# EAGLE design MRF49XA (EAGLE 6.6.0)
DATABASE: ../../partsDB.txt
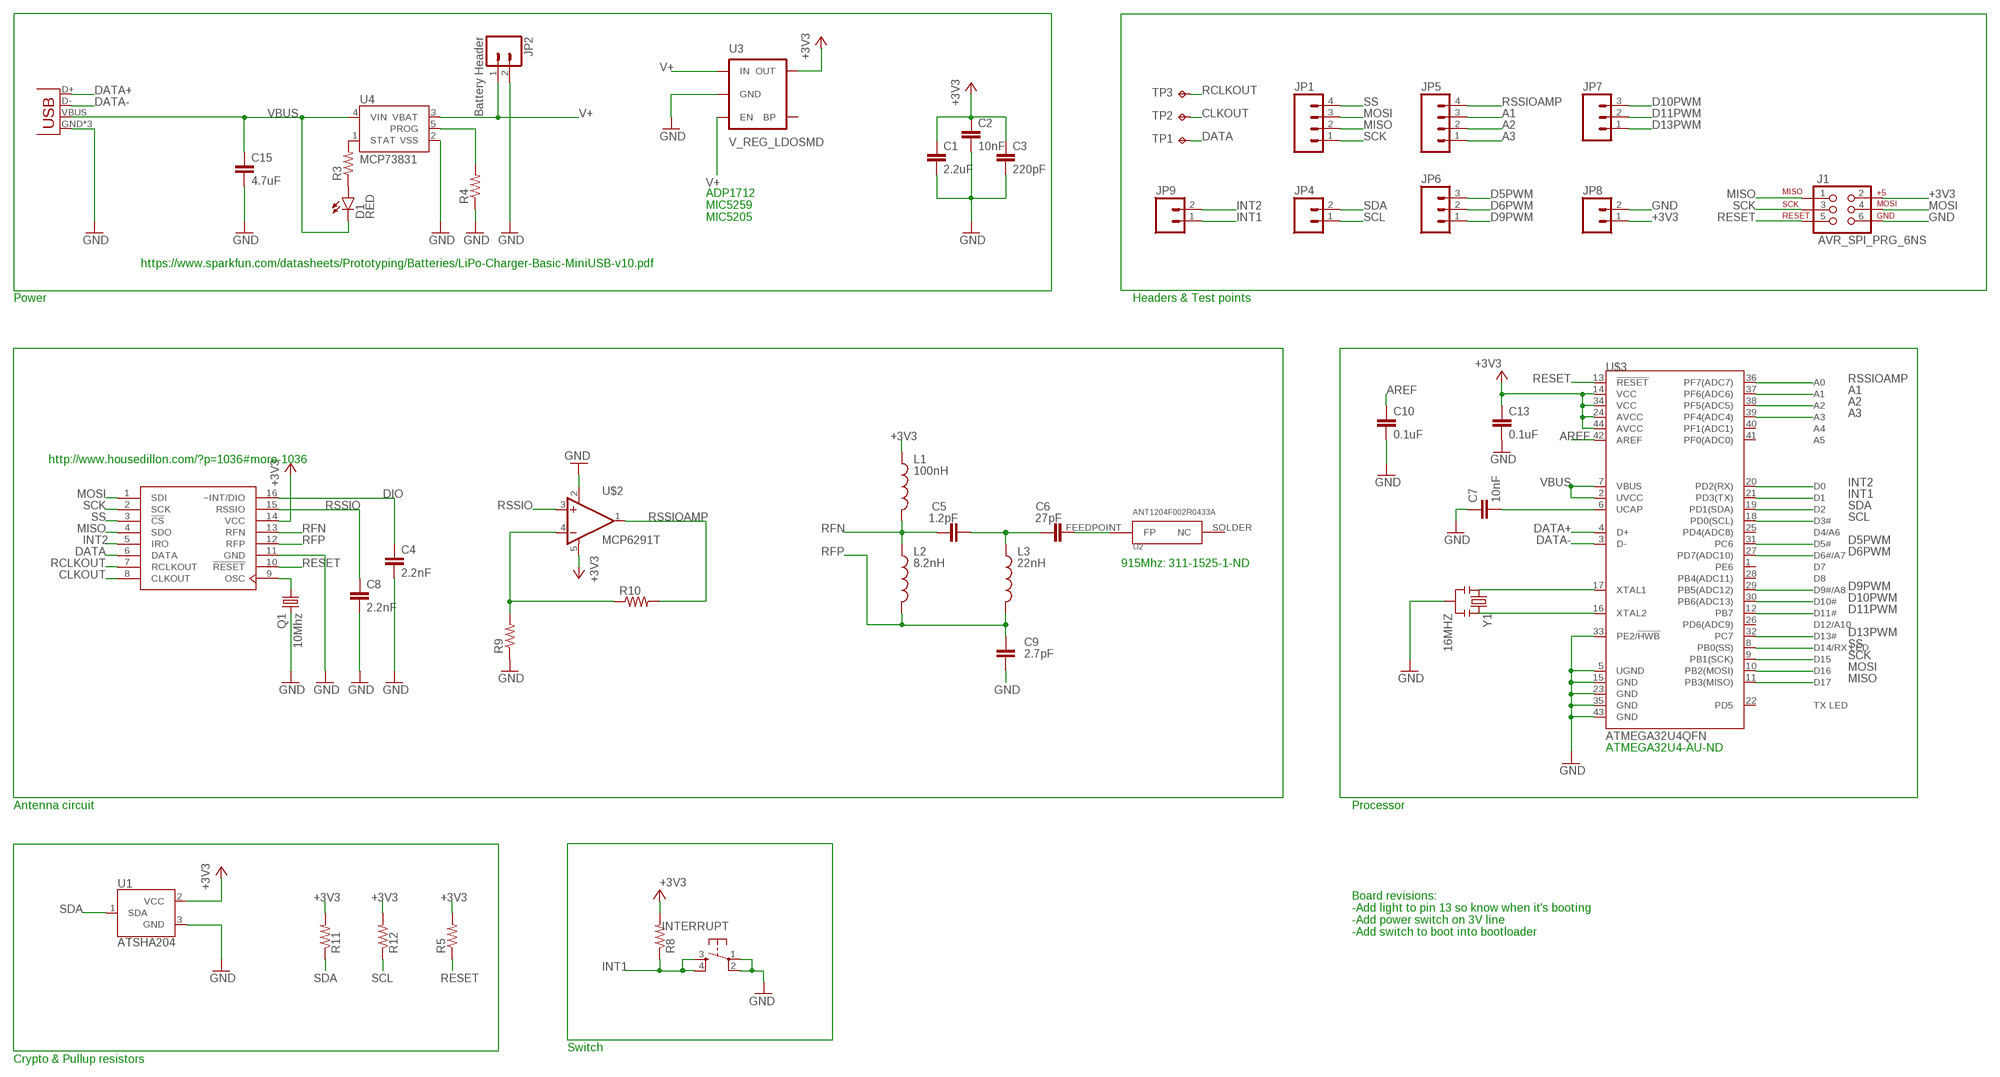
[diagram p0: schematic, sheet 1]

## Parts
C1  2.2uF  CAP0603-CAP  [0603-CAP]
C2  10nF  CAP0603-CAP  [0603-CAP]
C3  220pF  CAP0603-CAP  [0603-CAP]
C4  2.2nF  CAP0603-CAP  [0603-CAP]
C5  1.2pF  CAP0603-CAP  [0603-CAP]
C6  27pF  CAP0603-CAP  [0603-CAP]
C7  10nF  CAP0603-CAP  [0603-CAP]
C8  2.2nF  CAP0603-CAP  [0603-CAP]
C9  2.7pF  CAP0603-CAP  [0603-CAP]
C10  0.1uF  0.1UF-25V-5%(0603)  [0603-CAP]
C13  0.1uF  0.1UF-25V-5%(0603)  [0603-CAP]
C15  4.7uF  C-EUC3216  [C3216]
D1  RED  LED-RED0603  [LED-0603]
INTERRUPT  TAC_SWITCHSMD  [TACTILE-SWITCH-SMD]
J1  AVR_SPI_PRG_6NS  [2X3-NS]
JP1  M04PTH  [1X04]
JP2  Battery Header  M02LOCK_LONGPADS  [1X02_LOCK_LONGPADS]
JP3  USB-MICROB  [USB-MICROB]
JP4  M02PTH  [1X02]
JP5  M04PTH  [1X04]
JP6  M03PTH  [1X03]
JP7  M03PTH  [1X03]
JP8  M02PTH  [1X02]
JP9  M02PTH  [1X02]
L1  100nH  INDUCTOR0603  [0603]
L2  8.2nH  INDUCTOR0603  [0603]
L3  22nH  INDUCTOR0603  [0603]
Q1  10Mhz  CRYSTALCTS406  [CTS406]
R3  RESISTOR0603-RES  [0603-RES]
R4  R-US_R0603  [R0603]
R5  R-US_R0603  [R0603]
R8  R-US_R0603  [R0603]
R9  R-US_R0603  [R0603]
R10  R-US_R0603  [R0603]
R11  R-US_R0603  [R0603]
R12  R-US_R0603  [R0603]
TP1  TPTP08R  [TP08R]
TP2  TPTP08R  [TP08R]
TP3  TPTP08R  [TP08R]
U1  ATSHA204  ATSHA204-TSU  [SOT23-3]
U2  ANT1204F002R0433A  [ANT1204F002R0433A]
U3  V_REG_LDOSMD  [SOT23-5]
U4  MCP73831  [SOT23-5]
U$1  MRF49XA  [TSSOP16]
U$2  MCP6291T  MCP6291T-E/OT  [SOT23-5]
U$3  ATMEGA32U4QFN  [QFN-44]
Y1  16MHZ  RESONATOR8MHZ  [RESONATOR-SMD]

## Nets
+3V3: C1.1 C2.1 C3.1 C13.1 J1.2 JP8.1 L1.1 R5.2 R8.2 R11.2 R12.2 U1.2(VCC) U3.5(OUT) U$1.14(VCC) U$2.5(V+) U$3.14(VCC) U$3.24(AVCC) U$3.34(VCC) U$3.44(AVCC)
A1: JP5.3 U$3.37(PF6(ADC6))
A2: JP5.2 U$3.38(PF5(ADC5))
A3: JP5.1 U$3.39(PF4(ADC4))
AREF: C10.1 U$3.42(AREF)
CLKOUT: TP2.TP U$1.8(CLKOUT)
D5PWM: JP6.3 U$3.31(PC6)
D6PWM: JP6.2 U$3.27(PD7(ADC10))
D9PWM: JP6.1 U$3.29(PB5(ADC12))
D10PWM: JP7.3 U$3.30(PB6(ADC13))
D11PWM: JP7.2 U$3.12(PB7)
D13PWM: JP7.1 U$3.32(PC7)
DATA: TP1.TP U$1.6(DATA)
DATA+: JP3.D+ U$3.4(D+)
DATA-: JP3.D- U$3.3(D-)
DIO: C4.1 U$1.16(~INT/DIO)
GND: C1.2 C2.2 C3.2 C4.2 C7.1 C8.2 C9.2 C10.2 C13.2 C15.2 INTERRUPT.1 INTERRUPT.2 J1.6 JP2.2 JP3.GND JP3.MT1(GND) JP3.MT2(GND) JP8.2 Q1.3 R4.1 R9.1 U1.3(GND) U3.2(GND) U4.2(VSS) U$1.11(GND) U$2.2(V-) U$3.5(UGND) U$3.15(GND) U$3.23(GND) U$3.33(PE2/!HWB) U$3.35(GND) U$3.43(GND) Y1.2
INT1: INTERRUPT.3 INTERRUPT.4 JP9.1 R8.1 U$3.21(PD3(TX))
INT2: JP9.2 U$1.5(IRO) U$3.20(PD2(RX))
MISO: J1.1 JP1.2 U$1.4(SDO) U$3.11(PB3(MISO))
MOSI: J1.4 JP1.3 U$1.1(SDI) U$3.10(PB2(MOSI))
N$1: Q1.1 U$1.9(OSC)
N$2: U$3.16(XTAL2) Y1.3
N$3: U$3.17(XTAL1) Y1.1
N$5: R3.2 U4.1(STAT)
N$6: D1.A R3.1
N$8: R4.2 U4.5(PROG)
N$12: C7.2 U$3.6(UCAP)
N$14: C5.2 C6.1 L3.1
N$16: R9.2 R10.1 U$2.4(-IN)
N$17: C6.2 U2.FEEDPOINT(FP)
RCLKOUT: TP3.TP U$1.7(RCLKOUT)
RESET: J1.5 R5.1 U$1.10(!RESET) U$3.13(!RESET)
RFN: C5.1 L1.2 L2.1 U$1.13(RFN)
RFP: C9.1 L2.2 L3.2 U$1.12(RFP)
RSSIO: C8.1 U$1.15(RSSIO) U$2.3(+IN)
RSSIOAMP: JP5.4 R10.2 U$2.1(OUT) U$3.36(PF7(ADC7))
SCK: J1.3 JP1.1 U$1.2(SCK) U$3.9(PB1(SCK))
SCL: JP4.1 R12.1 U$3.18(PD0(SCL))
SDA: JP4.2 R11.1 U1.1(SDA) U$3.19(PD1(SDA))
SS: JP1.4 U$1.3(!CS) U$3.8(PB0(SS))
V+: JP2.1 U3.1(IN) U3.3(EN) U4.3(VBAT)
VBUS: C15.1 D1.C JP3.VBUS U4.4(VIN) U$3.2(UVCC) U$3.7(VBUS)
Unconnected: U2.SOLDER(NC) U3.4(BP) U$3.1(PE6) U$3.22(PD5) U$3.25(PD4(ADC8)) U$3.26(PD6(ADC9)) U$3.28(PB4(ADC11)) U$3.40(PF1(ADC1)) U$3.41(PF0(ADC0))

## Notes on the sheet
- ADP1712
  MIC5259
  MIC5205
- https://www.sparkfun.com/datasheets/Prototyping/Batteries/LiPo-Charger-Basic-MiniUSB-v10.pdf
- Power | Headers & Test points
- http://www.housedillon.com/?p=1036#more-1036
- 915Mhz: 311-1525-1-ND
- ATMEGA32U4-AU-ND
- Antenna circuit | Processor
- Board revisions:
  -Add light to pin 13 so know when it's booting
  -Add power switch on 3V line
  -Add switch to boot into bootloader
- Switch
- Crypto & Pullup resistors

## Power pins joined to a net without a drawn wire
VSS: U$1.P$1(VSS)

## Library data of the parts
C1 C5 C6 C9 = SparkFun-Passives:CAP: Capacitor Standard 0603 ceramic capacitor, and 0.1" leaded capacitor.
C2-C4 C7 C8 = SparkFun-Capacitors:CAP: Capacitor Standard 0603 ceramic capacitor, and 0.1" leaded capacitor.
C10 C13 = SparkFun-Capacitors:0.1UF-25V-5%(0603): CAP-08604; PROD_ID: CAP-08604
C15 = rcl:C-EU: CAPACITOR, European symbol
D1 = SparkFun-LED:LED-RED: Assorted Red LEDs LilyPad 1206- DIO-09912 1206- DIO-00809 0603- DIO-00819; PROD_ID: DIO-00819
INTERRUPT = SparkFun-Electromechanical:TAC_SWITCH: Momentary Switch Button commonly used for reset or general input. Spark Fun Electronics SKU : COM-00097 SMT- SWCH-08247
J1 = SparkFun-Connectors:AVR_SPI_PRG_6: AVR ISP 6 Pin This is the reduced ISP connector for AVR programming. Common on Arduino. This footprint will take up less PCB space and can be used with a 10-pin to 6-pin adapter such as SKU: BOB-08508 **Special note about "TEST_POINT" package. The stop mask is on the top side, so if you want your programming test points to be on the bottom of your board, make sure to place this package on the bottom side of the board. This also ensure that the orientation to program from the bottom side will be correct.
JP1 JP5 = SparkFun-Connectors:M04: Header 4 Standard 4-pin 0.1" header. Use with straight break away headers (SKU : PRT-00116), right angle break away headers (PRT-00553), swiss pins (PRT-00743), machine pins (PRT-00117), and female headers (PRT-00115). Molex polarized connector foot print use with SKU : PRT-08231 with associated crimp pins and housings. 1MM SMD Version SKU: PRT-10208
JP2 JP4 JP8 JP9 = SparkFun-Connectors:M02: Standard 2-pin 0.1" header. Use with - straight break away headers ( PRT-00116) - right angle break away headers (PRT-00553) - swiss pins (PRT-00743) - machine pins (PRT-00117) - female headers (PRT-00115) Molex polarized connector foot print use with: PRT-08233 with associated crimp pins and housings. 2.54_SCREWTERM for use with PRT-10571. 3.5mm Screw Terminal footprints for PRT-08084 5mm Screw Terminal footprints for use with PRT-08433
JP3 = SparkFun-Connectors:USB: USB Connectors USB-B-PTH is fully proven SKU : PRT-00139/CONN-08278 USB-miniB is fully proven SKU : PRT-00587 USB-A-PCB is untested. USB-A-H is throughly reviewed, but untested. Spark Fun Electronics SKU : PRT-00437 USB-B-SMT is throughly reviewed, but untested. Needs silkscreen touching up. USB-A-S has not been used/tested USB-MB-H has not been used/tested USB-MICROB has been used. CONN-09505; PROD_ID: CONN-09505
JP6 JP7 = SparkFun-Connectors:M03: Header 3 Standard 3-pin 0.1" header. Use with straight break away headers (SKU : PRT-00116), right angle break away headers (PRT-00553), swiss pins (PRT-00743), machine pins (PRT-00117), and female headers (PRT-00115). Molex polarized connector foot print use with SKU : PRT-08232 with associated crimp pins and housings.
L1-L3 = SparkFun-Passives:INDUCTOR: Inductors Basic Inductor/Choke - 0603 and 1206. Footprints are not proven and vary greatly between part numbers. SRN6045- 33uH, 20% 1.4A SDR0403-560KL - 56uH, 10%, 500mA RMS/740mA peak
Q1 = crystal:CRYSTAL: CRYSTAL; OC_FARNELL: unknown; OC_NEWARK: unknown
R3 = SparkFun-Passives:RESISTOR: Resistor Basic schematic elements and footprints for 0603, 1206, and PTH resistors.
R4 R5 R8-R12 = rcl:R-US_: RESISTOR, American symbol
TP1-TP3 = testpad:TP: Test pad
U1 = SparkFun-DigitalIC:ATSHA204: Atmel ATSHA204 The Atmel ATSHA204 is an optimized authentication chip that includes a 4.5Kb EEPROM. This array can be used for storage of keys, miscellaneous read/write, read-only, password or secret data, and consumption tracking. Access to the various sections of memory can be restricted in a variety of ways and then the configuration locked to prevent changes.
U2 = TestLibrary:ANT1204F002R0433A: ANT1204F002R0433A http://www.yageo.com/documents/recent/An_SMD_UHF_433_1204_0.pdf
U3 = SparkFun-PowerIC:V_REG_LDO: Voltage Regulator LDO Standard 150mA LDO voltage regulator in SOT-23 layout. Micrel part MIC5205. BP (by-pass) pin is used to lower output noise with 470pF cap.
U4 = SparkFun-PowerIC:MCP73831: Miniature single cell, fully integrated Li-Ion, Li-polymer charge management controller http://ww1.microchip.com/downloads/en/DeviceDoc/21984a.pdf IC-09995; PROD_ID: IC-09995
U$1 = microchip:MRF49XA
U$2 = SparkFun-AnalogIC:MCP6291: Rail to rail OpAmp with 10MHz GBP; PROD_ID: IC-11991
U$3 = SparkFun-DigitalIC:ATMEGA32U4: Atmel 44-pin 8-bit Microcontroller with 32KBytes of ISP Flash and USB Controller
Y1 = SparkFun-FreqCtrl:RESONATOR: Resonator Small SMD resonator. Used, eg, on the Arduino Pro/ Pro Mini boards. 8MHz- XTAL-08895 16MHz- XTAL-08900; PROD_ID: XTAL-08895; VALUE: 8MHZ

## Board
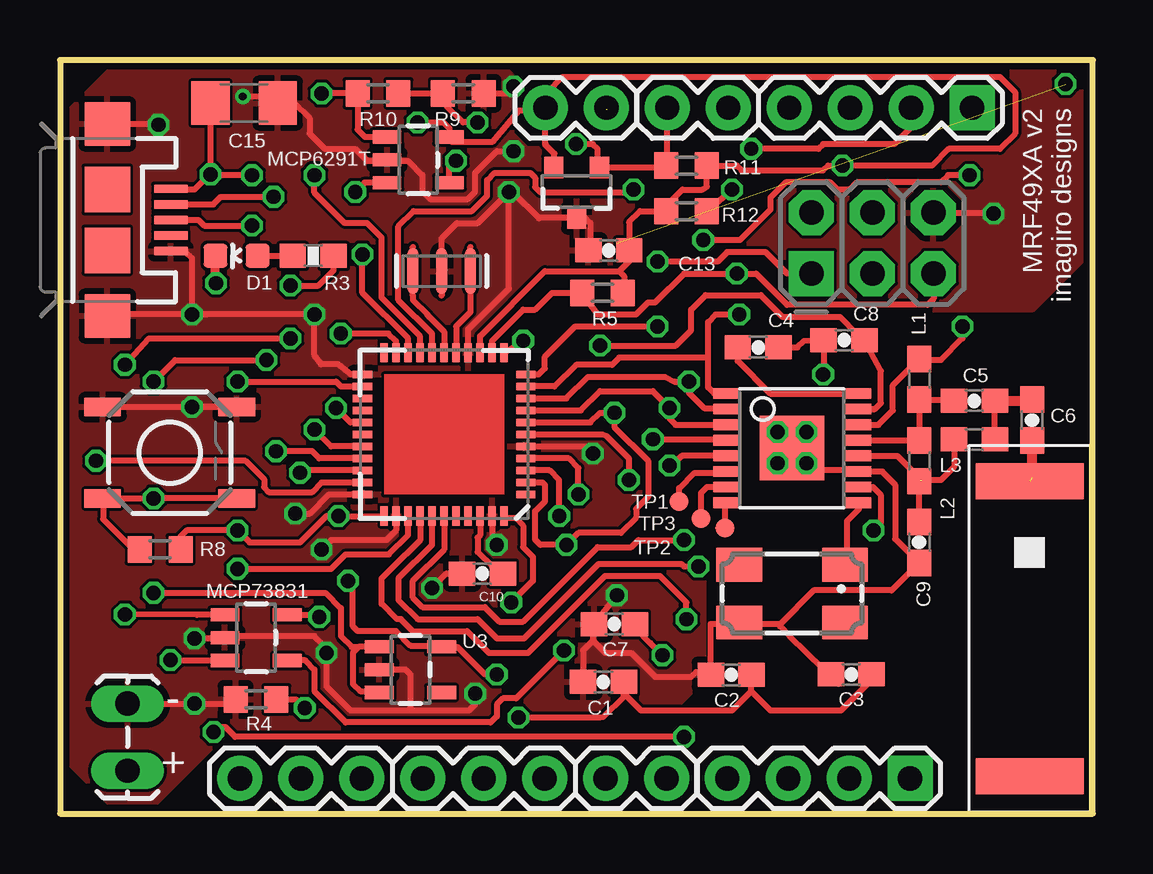
[diagram p1: board, top side]
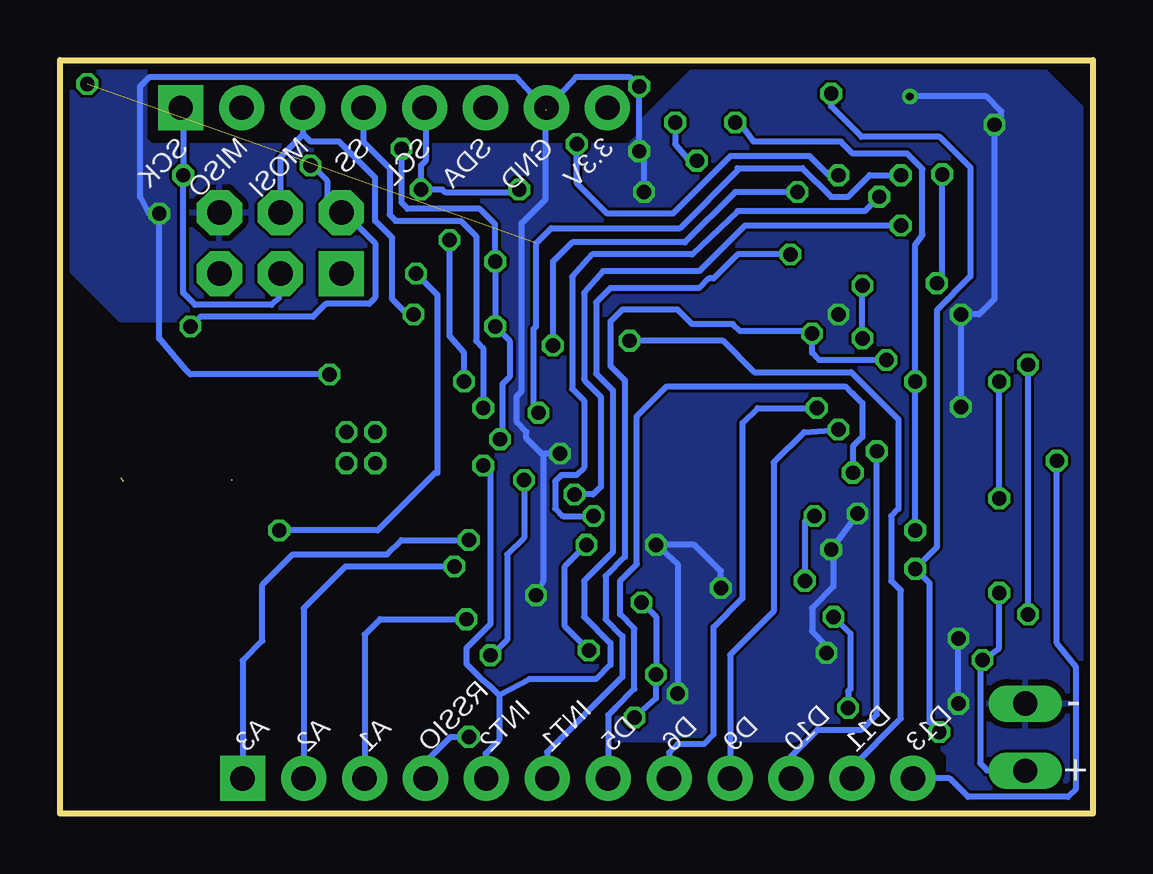
[diagram p2: board, bottom side, seen from below]

Size 43.03 x 31.4 mm. Coordinates in mm from the lower left corner, seen from the top.
Outline: 0,0 43.03,0 43.03,31.4 0,31.4 0,0
Copper layers (1*16): Top 0.035mm / dielectric 1.5mm / Bottom 0.035mm
Design rules "dirt_cheap_dirty_boards.v1": minimum track width 5mil, minimum drill 12mil, track to track 5mil, track to pad 5mil, pad to pad 5mil, via to via 5mil, smd to smd 0mil, copper to edge 10mil, drill to drill 10mil, minimum pad ring 10mil, minimum via ring 6mil, stop-mask expansion 2mil, vias tented up to drill 25mil, thermal gap 10mil

### Footprints (pad centres in the part's own frame; a part is rotated, then mirrored left to right if it is on the bottom)
0603-CAP = smd 1.1 x 1: 1 -0.85,0; 2 0.85,0
C3216 = smd 1.6 x 1.8: 1 -1.4,0; 2 1.4,0
LED-0603 = smd 1 x 1: A 0,-0.877; C 0,0.877
TACTILE-SWITCH-SMD = smd 1.524 x 0.762: 1 -2.794,1.905; 2 2.794,1.905; 3 -2.794,-1.905; 4 2.794,-1.905
2X3-NS = drill 1.016 pad 1.88 square: 1 -2.54,-1.27 | drill 1.016 pad 1.88 octagon: 2 -2.54,1.27; 3 0,-1.27; 4 0,1.27; 5 2.54,-1.27; 6 2.54,1.27
1X04 = drill 1.016 pad 1.88 square: 1 0,0 | drill 1.016 pad 1.88: 2 2.54,0; 3 5.08,0; 4 7.62,0
1X02_LOCK_LONGPADS = drill 1.016 long: 1 -0.127,0; 2 2.667,0
USB-MICROB = smd 0.35 x 1.4: D+ 0,2.65; D- -0.65,2.65; GND 1.3,2.65; ID 0.65,2.65; VBUS -1.3,2.65 | smd 1.8 x 1.9: MT1 -4,0; MT2 4,0 | smd 1.9 x 1.9: P$1 -1.27,0; P$2 1.27,0
1X02 = drill 1.016 pad 1.88: 1 0,0; 2 2.54,0
1X03 = drill 1.016 pad 1.88: 1 0,0; 2 2.54,0; 3 5.08,0
0603 = smd 1.1 x 1: 1 -0.85,0; 2 0.85,0
CTS406 = smd 1.9 x 1.4: 1 -2.2,-1.2; 2 2.2,-1.2; 3 2.2,1.2; 4 -2.2,1.2
0603-RES = smd 1.1 x 1: 1 -0.85,0; 2 0.85,0
R0603 = smd 1 x 1.1: 1 -0.85,0; 2 0.85,0
TP08R = smd 0.8 x 0.8: TP 0,0
SOT23-3 = smd 0.8 x 0.9: 1 -0.95,-1; 2 0.95,-1; 3 0,1.1
ANT1204F002R0433A = smd 1.5 x 4.5: FEEDPOINT -6.15,0; SOLDER 6.15,0
SOT23-5 = smd 0.55 x 1.2: 1 -0.95,-1.3; 2 0,-1.3; 3 0.95,-1.3; 4 0.95,1.3; 5 -0.95,1.3
TSSOP16 = smd 0.45 x 1.05: 1 -2.275,-2.768; 2 -1.625,-2.768; 3 -0.975,-2.768; 4 -0.325,-2.768; 5 0.325,-2.768; 6 0.975,-2.768; 7 1.625,-2.768; 8 2.275,-2.768; 9 2.275,2.768; 10 1.625,2.768; 11 0.975,2.768; 12 0.325,2.768; 13 -0.325,2.768; 14 -0.975,2.768; 15 -1.625,2.768; 16 -2.275,2.768 | smd 2.7 x 2.7: P$1 0,0
QFN-44 = smd 0.8 x 0.3: 1 -3.4,2.5; 2 -3.4,2; 3 -3.4,1.5; 4 -3.4,1; 5 -3.4,0.5; 6 -3.4,0; 7 -3.4,-0.5; 8 -3.4,-1; 9 -3.4,-1.5; 10 -3.4,-2; 11 -3.4,-2.5; 23 3.4,-2.5; 24 3.4,-2; 25 3.4,-1.5; 26 3.4,-1; 27 3.4,-0.5; 28 3.4,0; 29 3.4,0.5; 30 3.4,1; 31 3.4,1.5; 32 3.4,2; 33 3.4,2.5 | smd 0.3 x 0.8: 12 -2.5,-3.4; 13 -2,-3.4; 14 -1.5,-3.4; 15 -1,-3.4; 16 -0.5,-3.4; 17 0,-3.4; 18 0.5,-3.4; 19 1,-3.4; 20 1.5,-3.4; 21 2,-3.4; 22 2.5,-3.4; 34 2.5,3.4; 35 2,3.4; 36 1.5,3.4; 37 1,3.4; 38 0.5,3.4; 39 0,3.4; 40 -0.5,3.4; 41 -1,3.4; 42 -1.5,3.4; 43 -2,3.4; 44 -2.5,3.4
RESONATOR-SMD = smd 0.45 x 1.905: 1 -1.2,0; 2 0,0; 3 1.2,0

### Placement (x,y rotation side)
C1  22.64,5.48 180 top
C2  27.97,5.79 180 top
C3  32.97,5.8 180 top
C4  29.09,19.43 0 top
C5  38.1,17.2 0 top
C6  40.5,16.4 270 top
C7  23.1,7.9 0 top
C8  32.67,19.73 180 top
C9  35.8,11.3 270 top
C10  17.6,10 180 top
C13  22.87,23.47 180 top
C15  7.67,29.61 0 top
D1  7.36,23.24 90 top
INTERRUPT  4.57,15.04 0 top
J1  33.85,23.77 0 top
JP1  38,29.41 180 top
JP2  2.82,1.91 90 top
JP3  1.97,24.74 270 top
JP4  27.84,29.41 180 top
JP5  35.42,1.47 180 top
JP6  15.11,1.47 0 top
JP7  7.49,1.47 0 top
JP8  20.22,29.41 0 top
JP9  22.73,1.47 0 top
L1  35.8,18.1 270 top
L2  35.8,14.7 270 top
L3  38.1,15.6 180 top
Q1  30.5,9.17 180 top
R3  10.55,23.24 0 top
R4  8.17,4.76 0 top
R5  22.6,21.7 0 top
R8  4.17,11.01 0 top
R9  16.8,30.01 180 top
R10  13.25,30.01 180 top
R11  26.1,27 0 top
R12  26.1,25.1 180 top
TP1  25.8,13 0 top
TP2  27.7,11.9 0 top
TP3  26.7,12.3 0 top
U1  21.53,25.92 180 top
U2  40.4,7.7 270 top
U3  14.6,6 270 top
U4  8.17,7.33 270 top
U$1  30.5,15.23 270 top
U$2  14.93,27.24 270 top
U$3  16,15.8 180 top
Y1  15.9,22.6 0 top

### Tracks (layer width: path | path; a pad name or v marks a point on that pad's centre or on a via)
+3V3  (via drill 0.6)
  Top 0.152: 20.3,29.88 20.32,29.88 JP8.1
  Top 0.254: 28.8,5.79 C2.1 28.8,5.77 28.8,5.1 | C3.1 33.82,5.57 32.55,4.3 29.6,4.3 28.8,5.1 | 20.38,26.89 U1.2 20.6,26.95 20.6,27.5 20.2,27.9 20.22,27.92 JP8.1 20.12,29.3 19.14,29.3 18.04,28 16.3,28 16.3,28.19 U$2.5 16.23,28.55 15.97,28.8 v14.9,28.8 | v7.4,18 11.5,18 11.7,17.8 U$3.24 | R8.2 5.02,11.55 5.28,11.8 v7.4,11.8 7.9,11.3 10,11.3 11.1,12.4 v11.6,12.4 U$3.34 | U$3.14 17.5,19.9 20.2,22.6 23.3,22.6 | L1.1 35.84,18.95 | U$1.14 33.36,16.2 34.1,16.2 34.7,16.8 34.7,17.85 L1.1 | 23.3,22.6 23.5,22.4 23.5,21.75 R5.2 | 23.3,22.6 23.72,23.02 C13.1 23.72,24.61 23.7,24.63 24.17,25.1 R12.2 25.2,25.2 25.3,24.66 25.3,25.36 25.93,26 26.77,26 26.95,26.12 R11.2 28.2,27 28.4,26.8 31.8,26.8 32,27 v32.6,27 36.34,27 37.03,27.7 39.16,27.7 39.8,28.33 39.8,30.06 39.16,30.7 20.93,30.7 20.3,30.06 20.3,29.88 20.3,29.4 20.2,29.3 | v37.6,20.3 37.6,19.8 36.7,18.9 35.85,18.9 L1.1 | 28.8,5.1 28,4.3 24.2,4.3 23.49,5.01 C1.1 23.49,4.91 23.5,4.9 22.62,4.03 22.5,4 v19.1,4 | v18.8,8.8 19.7,9.7 19.7,10.7 19.3,11.1 19.3,12 19,12.3 18.6,12.3 U$3.44 | v18.2,5.8 17.7,5.8 16.55,6.95 U3.5 15.85,7 14.6,7 14,7.6 12.4,7.6 12.2,7.8 12.2,9.5 v12,9.7
  Bottom 0.254: v32.6,27 32.53,27 31.9,26.36 31.9,25.7 J1.2 31.17,25.04 29.9,23.77 29.9,21.49 30.15,21.24 31.96,21.24 32.5,20.7 37.2,20.7 v37.6,20.3 | v7.4,11.8 v7.4,18 7.4,23.7 7.1,24.1 7.1,26.86 7.74,27.5 10,27.5 10.5,28 14.13,28 14.7,28.77 v14.9,28.8 | v19.1,4 18.2,4.8 v18.2,5.8 18.2,8.2 v18.8,8.8 | v11.6,12.4 11.8,12.4 12,12.2 v12,9.7
A1  (via drill 0.6)
  Top 0.254: v26.1,8.1 26.1,8.8 25,9.9 22.7,9.9 19.5,6.7 17.86,6.7 16.96,7.6 14.7,7.6 14.2,8.1 14.04,8.1 13.4,8.74 13.4,9.8 13.8,10.2 15,11.4 U$3.37 15,12.6
  Bottom 0.254: v26.1,8.1 29.7,8.1 30.34,7.46 JP5.3
A2  (via drill 0.6)
  Top 0.254: U$3.38 15.5,11.2 14.1,9.8 14.1,8.9 14.9,8.1 17.4,8.1 18.2,7.3 19.34,7.3 22.43,10.4 25.9,10.4 26,10.3 v26.6,10.3
  Bottom 0.254: v26.6,10.3 31.13,10.3 32.88,8.55 JP5.2
A3  (via drill 0.6)
  Top 0.254: v26,11.4 24.1,11.4 23.8,11.1 22.4,11.1 19.3,8 18.3,8 17.7,8.6 15.1,8.6 14.7,9 14.7,9.7 16,11 U$3.39
  Bottom 0.254: v26,11.4 28.8,11.4 29.4,10.8 33.33,10.8 34.6,9.53 34.6,7.2 35.42,6.38 JP5.1
AREF
  Top 0.254: 18.15,10.05 C10.1 18.15,10.3 18,10.3 17.4,10.9 17.4,11.5 17.5,11.6 U$3.42
CLKOUT
  Top 0.254: U$1.8 27.8,12.96 27.7,12.9 TP2.TP
D5PWM  (via drill 0.6)
  Top 0.254: U$3.31 10.1,14.3 v10,14.2
  Bottom 0.254: JP6.3 20.19,4.11 19.9,4.39 19.9,4.4 19.1,5.2 19.1,7.7 19.7,8.3 19.7,9.7 19,10.4 19,16.53 19.02,16.55 17.75,17.8 10.32,17.8 10.02,17.5 10,17.5 9.6,17.1 9.6,15.7 10,15.3 v10,14.2
D6PWM  (via drill 0.6)
  Top 0.254: U$3.27 12.1,16.3 v11.5,16.9
  Bottom 0.254: v11.5,16.9 13.96,16.9 14.6,16.26 14.6,8.96 15.8,7.77 15.8,3.3 16.2,2.9 17.3,2.9 17.65,2.55 JP6.2
D9PWM  (via drill 0.6)
  Top 0.254: U$3.29 11.3,15.3 v10.6,16
  Bottom 0.254: v10.6,16 12.03,15.9 13.3,14.63 13.3,8.43 15.11,6.62 JP6.1
D10PWM  (via drill 0.6)
  Top 0.254: U$3.30 10.8,14.8 10.5,15.1 v9,15.1
  Bottom 0.254: v9,15.1 9,4.14 9.63,3.5 11.46,3.5 12.57,2.39 JP7.3
D11PWM  (via drill 0.6)
  Top 0.254: U$3.12 v19.3,19.7
  Bottom 0.254: v19.3,19.7 15.4,19.7 14.1,18.4 10.07,18.4 8.1,16.43 8.1,12.7 8.4,12.4 8.4,9.7 8,9.3 8,3.97 10.03,1.94 JP7.2
D13PWM  (via drill 0.6)
  Top 0.254: v1.5,14.7 7.74,14.7 8.5,13.94 8.5,13.6 8.7,13.4 10.5,13.4 10.9,13.8 U$3.32
  Bottom 0.254: v1.5,14.7 1.5,7.1 0.7,6.1 0.7,1.04 1.03,0.7 5.2,0.7 5.97,1.47 JP7.1
DATA
  Top 0.254: TP1.TP 25.8,13.56 26.43,14.2 27.68,14.2 U$1.6
DATA+  (via drill 0.6)
  Top 0.254: v21.6,13.3 21.6,14.4 21.2,14.8 U$3.4 | JP3.D+ 5.76,24.74 6,24.5 v8,24.5
  Bottom 0.254: v21.6,13.3 20.82,13.3 20.5,13.62 20.5,17.36 21.14,18 21.2,18.1 21.2,21.7 20.4,22.6 16.4,22.6 14.5,24.5 v8,24.5
DATA-  (via drill 0.6)
  Top 0.254: v20.8,12.4 20.8,13.9 20.4,14.3 U$3.3 | JP3.D- 6.39,25.39 6.7,25.7 v8.9,25.7
  Bottom 0.254: v20.8,12.4 22.08,12.4 22.4,12.72 22.4,13.85 22.15,14.1 21.52,14.1 21.2,14.42 21.2,17.2 21.7,17.7 21.7,22.36 20.86,23.3 16.7,23.3 14.8,25.1 9.5,25.1 v8.9,25.7
DIO
  Top 0.254: U$1.16 29.6,17.5 28.24,18.86 C4.1
GND  (via drill 0.33, 0.6)  (1 unrouted)
  Top 0.152: 8.89,29.88 C15.2 | 17.78,20.99 17.8,20.97 | 22.09,23.53 C13.2
  Top 0.254: INTERRUPT.1 INTERRUPT.2 v5.5,16.94 | JP3.MT2 2,20.8 2,20.7 2.14,20.84 5.5,20.84 | 5.5,20.84 5.5,23.15 5.25,23.4 4.62,23.4 JP3.GND | C3.2 32.44,5.4 31.8,6.04 30.4,7.4 30,7.8 30,7.9 | v18.7,25.9 18.86,25.9 19.96,24.8 19.99,24.82 U1.3 21.88,24.82 22.1,24.6 22.1,23.55 C13.2 | 15.9,23.7 15.9,23.62 15.9,23.96 16.54,24.6 17.4,24.6 v18.7,25.9 | 30,7.9 31.4,9.3 34.65,9.3 C9.2 34.8,11.45 34.8,13.7 34.27,14.24 34.27,14.26 U$1.11 | C15.2 9.77,29.61 10.4,28.97 10.4,28.33 11.04,27.7 12.3,27.7 12.8,27.2 13.63,27.2 | 13.63,27.2 U$2.2 | 22.23,7.2 C7.1 v23.2,9.1 | U$3.23 12.12,18.3 11.6,18.72 10.88,18.72 10.6,19.1 v10.6,20.8 v5.5,20.8 6.1,20.8 5.5,20.84 | U$3.15 17,20.18 17.32,20.5 17.33,20.5 17.8,20.97 18.7,21.87 v18.7,25.9 | JP2.2 v5.6,4.58 7.32,4.58 R4.1 | R9.1 18.7,30.01 v18.9,30.3 | 12.15,13.3 U$3.33 11.2,13.3 10.4,12.5 v9.8,12.5 | JP3.MT1 4.1,28.74 v4.1,28.7 | U$3.5 21.9,15.3 v22.2,15 | 13.63,27.2 14.5,27.2 15.1,26.6 15.1,25.92 15.42,25.6 16.98,25.6 17.3,25.92 17.3,26.7 18.2,27.6 v18.9,27.6 | v5.6,7.3 6.94,7.3 U4.2 6.97,7.4 10.6,7.4 11,7 v11.1,6.7 11.1,5.3 12.1,4.3 14.5,4.3 14.6,4.4 | v7.62,29.88 8.89,29.88 | 22.23,7.2 22.73,6.7 23.8,6.7 24.8,5.7 26.3,5.7 26.5,5.9 27.09,5.88 27.09,7.9 28.3,7.9 Q1.3 28.37,7.9 30,7.9 | 22.23,7.2 22.2,7.2 21.8,6.8 21.8,5.39 C1.2 | J1.6 38.86,25.04 v38.9,25 | C4.2 30.73,19.43 31,19.7 C8.2 31.82,18.32 v31.8,18.3 | 14.6,4.4 14.6,4.3 17.05,4.3 17.3,4.55 v17.3,5 | U$3.35 14,11.8 13.6,11.4 11.3,11.4 v10.9,11 | 14.6,4.4 14.6,5.8 14.4,6 U3.2 | U$3.43 18,11.5 v18.2,11.2 | C10.2 16.1,10 v15.5,9.4
  Top 0.406: 27.09,5.88 C2.2
  Bottom 0.152: 3.81,28.61 v4.1,28.7
  Bottom 0.254: v5.5,16.94 v5.5,20.8 4.74,20.8 4.1,21.43 v4.1,28.7 | 22.8,29.33 21.53,30.7 19.3,30.7 v18.9,30.3 v18.9,27.6 18.7,27.4 v18.7,25.9 | v5.6,4.58 v5.6,7.3 | v9.8,12.5 v10.9,11 10.8,10.9 10.8,9.46 11.7,8.56 11.7,7.6 11.1,7 v11.1,6.7 | 22.9,15 22.9,9.68 v23.2,9.1 | v22.2,15 22.9,15 | 22.9,15 22.96,15 23.6,15.63 23.6,15.9 24,16.3 24,17.4 23.8,17.6 23.8,24.6 22.8,25.6 22.8,29.16 JP8.2 22.76,29.33 24.03,30.7 39.3,30.7 39.7,30.3 39.7,25.7 39.34,25 38.9,25.06 v38.9,25 38.9,19.8 37.8,18.5 37.6,18.3 v31.8,18.3 | 3.81,28.61 3.81,29.24 4.45,29.88 v7.62,29.88 | v17.3,5 17.3,10.4 v18.2,11.2 16.6,11.2 15.5,10.1 v15.5,9.4
  pour Bottom (rank 6): 5.26,0 2.5,0 0,2.5 0,28.9 2.5,31.4 16.2,31.4 18.7,28.9 18.7,28.43 19.34,27.8 39.25,27.8 39.5,28.05 39.5,31.4 42.75,31.4 43,31.25 43,23.1 40.5,20.6 29.5,20.6 27,18.1 27,12.6 27.1,5.8 27.1,5.6 24.6,3.1 6.63,3.1 6,2.46 6,0.84
  pour Top: 6,2.46 3.54,0 2.5,0 0,2.5 0,28.9 2.5,31.4 18.16,31.4 18.8,30.76 18.8,28.33 19.43,27.7 39.45,27.7 39.7,27.95 39.7,31.4 42.75,31.4 43,31.15 43,23.5 40.5,21 29.3,21 26.8,18.5 26.8,5.6 24.3,3.1 6.63,3.1
INT1  (via drill 0.6)
  Top 0.254: 1.8,13.13 v3.9,13.13 INTERRUPT.4 | INTERRUPT.3 1.8,13.13 | 1.8,13.13 1.8,12.27 3.07,11 3.22,11 R8.1 | U$3.21 14,19.68 13.68,20 v11.7,20 | v3.9,18 4.8,18.9 v8.6,18.9
  Bottom 0.254: v3.9,13.13 v3.9,18 | v8.6,18.9 11.4,18.9 11.7,19.2 v11.7,20 11.7,20.1 14.7,20.1 15,20.4 16.7,20.4 17.3,21 19.6,21 20.1,20.5 20.1,18.65 19.5,18.05 19.5,10.7 20.3,9.9 20.3,8.1 19.6,7.4 19.6,5.7 22.73,2.57 JP9.1
INT2  (via drill 0.6)
  Top 0.254: U$3.20 14.5,19.8 12.6,21.7 v12.6,23.3 | U$1.5 25.91,14.91 25.9,14.9 v25.4,14.5
  Bottom 0.254: v12.6,23.3 14.8,23.3 15.8,22.3 16,22.3 16.4,21.9 20.1,21.9 20.7,21.3 20.7,18.33 20,17.63 20,10.9 21.2,9.7 21.2,8.2 20.1,7.1 20.1,6.2 20.7,5.6 23.47,5.6 24.74,4.93 | v25.4,14.5 25.1,14.3 25.1,7.9 26.1,6.9 26.1,6.24 25.46,5.6 25.11,5.3 24.74,4.93 | 24.74,4.93 24.74,3.06 25.3,2.5 25.3,1.5 JP9.2
MISO  (via drill 0.6)
  Top 0.254: U$3.11 19.95,18.3 20.2,18.55 20.2,19.03 21.47,20.3 v24.9,20.3 | v24.7,15.6 27.73,15.6 U$1.4 | J1.1 30.3,22.5 29.4,23.4 27.8,23.4 27.4,23 25.8,23 25.4,23 v24.9,23 | JP1.2 35.4,29.18 35.4,28.54 34.77,27.9 31.8,27.9 31.6,27.7 v28.8,27.7
  Bottom 0.254: v24.7,15.6 24.6,15.7 24.6,17.9 24.3,18.2 24.3,19.7 v24.9,20.3 v24.9,23 24.9,24.56 25.54,25.2 28.55,25.2 28.8,25.45 v28.8,27.7
MOSI  (via drill 0.6)
  Top 0.254: U$1.1 27.25,17.51 27,17.76 27,19 | 27,19 23.3,19 23,18.7 21.5,18.7 20.6,17.8 U$3.10 | 27,19 27,20.48 27.32,20.8 v28.3,20.8
  Bottom 0.254: 32.9,29.17 JP1.3 32.89,28.31 | J1.4 33.85,27.36 33.84,27.36 32.89,28.31 | v28.3,20.8 28.57,20.8 29.2,21.43 29.2,24 29.9,24.7 29.9,26.5 31.4,28 32.58,28 32.89,28.31
N$1
  Top 0.254: Q1.1 33.3,10.37 32.8,10.5 32.8,12.2 33.3,12.7 33.3,12.9 33.27,12.9 U$1.9
N$2
  Top 0.254: 17.1,21.58 17.1,21.4 17.1,21.1 | 17.1,21.1 | 17.1,21.1 17.1,20.9 16.5,20.3 U$3.16
N$3
  Top 0.254: 14.7,21.58 14.7,21.4 15.3,20.8 15.38,20.7 16,20.08 U$3.17
N$4  (via drill 0.6)
  other vias: 29.9,15.9
N$5  (via drill 0.6)
  Top 0.254: U4.1 5.7,8.28 v2.7,8.3 | v2.7,18.7 3.7,19.8 v9.6,19.8 | v9.6,22 10.76,22 11.4,22.63 R3.2
  Bottom 0.254: v2.7,8.3 v2.7,18.7 | v9.6,19.8 v9.6,22
N$6
  Top 0.254: D1.A R3.1
N$7  (via drill 0.6)
  other vias: 31.1,15.9
N$8  (via drill 0.6)
  Top 0.254: U4.5 10.78,8.28 v10.8,8.2 | R4.2 9.84,4.76 v10.2,4.4
  Bottom 0.254: v10.8,8.2 10.1,7.5 10.1,5.2 10.2,5.1 v10.2,4.4
N$9  (via drill 0.6)
  other vias: 29.9,14.6
N$10  (via drill 0.6)
  other vias: 31.1,14.6
N$11
  Top 0.254: 32.8,14.3 31.6,14.3 31.5,14.2
N$12  (via drill 0.6)
  Top 0.254: U$3.6 22.59,15.8 22.77,15.73 23.7,14.8 v23.7,13.9 23.8,13.8 | C7.2 24,7.88 24,7.7 24.6,7.1 v25.1,6.6
  Bottom 0.254: v25.1,6.6 25.04,6.6 24.4,7.24 24.4,10.8 23.7,11.5 v23.7,13.9
N$14
  Top 0.254: L3.1 C5.2
  Top 0.406: C5.2 40.5,17.2 C6.1
N$16  (via drill 0.6)
  Top 0.254: R10.1 R9.2 16.1,29.87 16.1,29.5 16.8,28.8 v17.4,28.8 | U$2.4 16.23,27.03 v16.5,27.2
  Bottom 0.254: v17.4,28.8 17.4,27.9 16.9,27.3 v16.5,27.2
N$17  (1 unrouted)
  Top 0.406: 40.5,14 C6.2
RCLKOUT
  Top 0.254: U$1.7 26.95,13.61 26.7,13.35 TP3.TP
RESET  (via drill 0.6)
  Top 0.254: U$3.13 18,19.7 19.3,21 19.8,21 20.5,21.7 21.7,21.7 | 22.05,21.7 R5.1 21.7,21.7 | 21.7,21.7 22.4,20.8 24,20.8 24.5,21.3 24.8,21.3 26,22.5 v28.2,22.5 29,22.5 30.3,21.2 36.15,21.2 36.4,21.45 36.4,22.49 J1.5 | U$1.10 33.88,13.61 34.19,13.29 34.19,12.09 v33.9,11.8
  Bottom 0.254: v28.2,22.5 27.3,21.6 27.3,14.2 27.4,14.2 29.8,11.8 v33.9,11.8
RFN
  Top 0.254: C5.1 37.2,17.25 L1.2 L2.1 U$1.13
RFP  (1 unrouted)
  Top 0.254: C9.1 L2.2 35.85,13.9 36.7,13.9 37.25,14.45 L3.2 | U$1.12 34.89,14.91 35.9,13.9
RSSIO  (via drill 0.6)
  Top 0.254: U$2.3 12.69,26.29 v12.3,25.9 | v22.5,19.5 25.66,19.5 26.3,20.13 26.3,21 26.9,21.6 29.2,21.6 30.1,20.7 32.5,20.7 33.2,20 33.2,19.45 C8.1 34.2,18.45 34.2,17.1 33.96,16.86 U$1.15 33.86,16.86
  Bottom 0.254: v12.3,25.9 14.9,25.9 17,23.8 21.7,23.8 22.5,23 v22.5,19.5
RSSIOAMP  (via drill 0.6)
  Top 0.254: v26,3.2 7.3,3.2 6.9,3.6 6.4,3.6 v6.4,3.4 | v10.9,30 10.91,30.01 R10.2 12.4,28.5 12.7,28.2 13.62,28.2 U$2.1 | v7.4,10.2 11.3,10.2 11.9,10.8 13.7,10.8 14.5,11.6 U$3.36
  Bottom 0.254: v26,3.2 26.76,3.2 27.8,2.15 JP5.4 | v10.9,30 10.9,29.47 9.63,28.2 6.37,28.2 5.1,26.93 5.1,22.38 6.5,20.98 6.5,11.1 v7.4,10.2 6.8,9.6 6.8,3.8 v6.4,3.4
SCK  (via drill 0.6)
  Top 0.254: U$3.9 21.1,17.3 22,18.2 25.2,18.2 25.6,18 v26.2,18 26.2,17.54 26.84,16.9 27.73,16.9 U$1.2 | v37.9,26.6 37,26.6 36.7,26.3 33.2,26.3 32.9,26 32.4,26 32.1,26.3 30.23,26.3 29.6,25.66 29.6,25.17 28.33,23.9 v26.8,23.9
  Bottom 0.254: JP1.1 37.9,29.18 v37.9,26.6 37.9,21.7 37.4,21.2 34.23,21.2 33.91,21.49 33.9,21.63 33.9,22.45 J1.3 | v26.2,18 26.2,19.2 26.8,19.9 v26.8,23.9 26.8,24
SCL  (via drill 0.6)
  Top 0.254: R12.1 v28,26 | U$3.18 15.5,20 14.1,21.4 14.1,24.46 14.73,25.1 17.16,25.1 17.8,25.73 17.8,26.4 18.1,26.7 19.6,26.7 19.8,26.5 19.8,26.1 20,25.9 23.8,25.9 v23.9,26
  Bottom 0.254: JP4.1 27.8,29.19 27.8,27.2 28,27 v28,26 27.1,26 27,25.9 24,25.9 v23.9,26
SDA  (via drill 0.6)
  Top 0.254: JP4.2 25.3,26.8 R11.1 25.25,26.92 U1.1 22.4,27 22.4,27.7 22.2,27.9 v21.5,27.9 | U$3.19 15,19.88 14,20.9 13.4,21.5 13.4,24 12.8,24.6 11.87,24.6 10.6,25.87 v10.6,26.6
  Bottom 0.254: v10.6,26.6 11,26.6 11.8,27.4 15.1,27.4 17.5,25 20.23,25 21.5,26.27 v21.5,27.9 21.5,27.8
SS  (via drill 0.6)
  Top 0.254: U$3.8 21.7,16.8 22.5,17.6 24.7,17.6 v25.4,16.9 25.4,16.45 25.65,16.2 U$1.3
  Bottom 0.254: JP1.4 30.4,29.13 30.4,28 29.3,26.9 29.3,24.95 29.05,24.7 26.34,24.7 25.7,24.06 25.7,19.7 25.4,19.4 v25.4,16.9
V+  (via drill 0.6)
  Top 0.254: v4.6,6.4 6.97,6.4 U4.3 | v3.9,9.2 11.06,9.2 11.7,8.56 11.7,7.4 12.15,6.95 12.45,6.95 | U3.1 12.45,6.95 | 12.45,6.95 12.2,6.7 12.2,5.4 12.5,5.1 13.25,5.1 U3.3
  Bottom 0.254: v3.9,9.2 3.9,6.9 v4.6,6.4 4.7,6.3 4.7,2.1 4.4,1.8 JP2.1
VBUS  (via drill 0.6)  (1 unrouted)
  Top 0.152: D1.C 6.35,23.53 6.35,22.26 v6.5,22.1
  Top 0.254: 6.5,23.24 v6.5,22.1 | U$3.7 22.1,16.3 22.5,16.7 v23.1,16.7 23.1,16.1 24.5,14.7 24.5,13.2 24,12.7 24,12.34 23.36,11.7 21.6,11.7 v21.1,11.2 20.02,11.2 19.8,11.42 19.8,12.6 20.2,13 20.2,13.7 20.1,13.8 U$3.2 | v8,26.6 6.27,26.6 v6.27,26.64 | v6.27,26.64 6.24,26.64 5.6,26 4.62,26 JP3.VBUS | v6.27,26.64 C15.1 | 9.65,6.3 U4.4 10.22,6.38 10.6,6 10.6,5.1 11.9,3.8 17.95,3.8 18.2,4.05 18.2,4.55 18.45,4.8 19,4.8 v21,6.8
  Bottom 0.254: v6.5,22.1 6.27,22.2 v6.27,26.64 | v23.1,16.7 23.2,16.7 23.3,16.8 23.3,20.2 23.2,20.3 23.2,23.76 22.57,24.4 17.2,24.4 14.8,26.8 14.8,26.9 12.1,26.9 10.9,25.7 10.2,25.7 9.3,26.6 v8,26.6 | v21.1,11.2 22,10.3 22,7.8 v21,6.8
  other vias: 41.9,30.4

### Text on the board
tPlace: - | +
tNames: MRF49XA v2 / imagiro designs
bNames: 3.3V | GND | SDA | SCL | SS | MOSI | MISO | SCK | - | D13 | D11 | D10 | D9 | D6 | D5 | INT1 | INT2 | RSSIO | A1 | A2 | A3 | +
_tsilk: LM317 | GND | R1 | R2 | RSSIO | .01uF | Fence | 2.2uF | 2.2nF | 220pF | !CS | 2.2nF | 10nF | SDO | IRO | 33nH | 5.1pF | MRF49XA | 47nH | 2.2nF | 390nH | RCO | 2.7pF | 68pF | 10Mhz
_bsilk: V+ | SDI | DATA | CLKOUT | !RESET | TAPR Open Hardware License | Licensed under the | (C) 2010 - William Dillon KD7VMY | Philomath Oregon | Custom Radio Devices | MRF49XA Breakout Board Rev. 1 | 3.3v